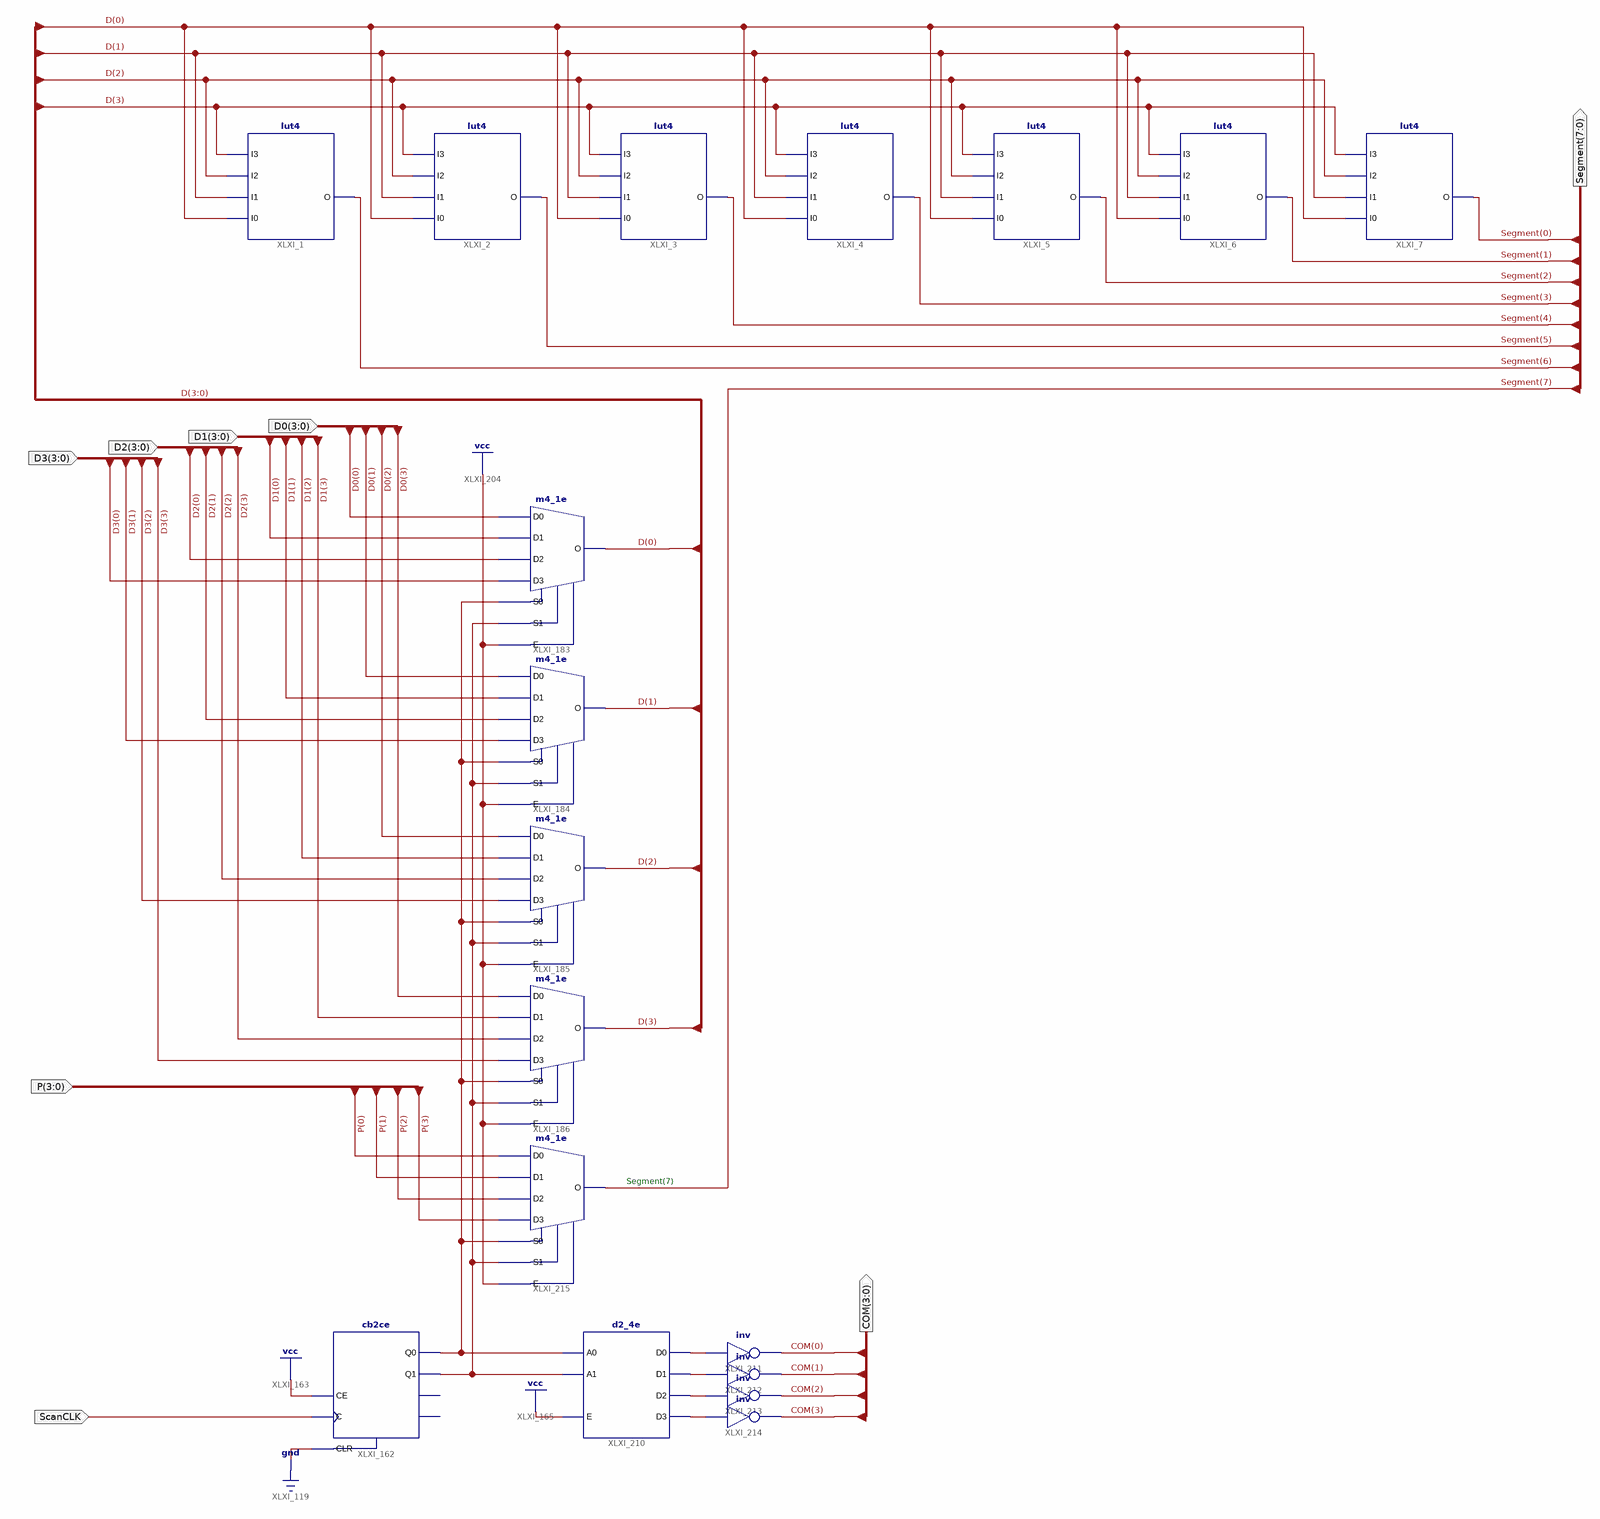
[diagram p0: schematic sheet 1]
// Xilinx ISE schematic ssd4d0ftpb.sch (spartan6) as structural Verilog: 18 symbols, 8 ports
module ssd4d0ftpb (
  input  [3:0] D0,
  input  [3:0] D1,
  input  [3:0] D2,
  input  [3:0] D3,
  input  [3:0] P,
  input  ScanCLK,
  output [7:0] Segment,
  output [3:0] COM
);

  wire XLXN_236, XLXN_237, XLXN_238, XLXN_239, XLXN_290, XLXN_291;
  wire [3:0] D;

  lut4 #(.INIT("EF7C")) XLXI_1 (.I0(D[0]), .I1(D[1]), .I2(D[2]), .I3(D[3]), .O(Segment[6]));
  lut4 #(.INIT("DF71")) XLXI_2 (.I0(D[0]), .I1(D[1]), .I2(D[2]), .I3(D[3]), .O(Segment[5]));
  lut4 #(.INIT("FD45")) XLXI_3 (.I0(D[0]), .I1(D[1]), .I2(D[2]), .I3(D[3]), .O(Segment[4]));
  lut4 #(.INIT("7B6D")) XLXI_4 (.I0(D[0]), .I1(D[1]), .I2(D[2]), .I3(D[3]), .O(Segment[3]));
  lut4 #(.INIT("2FFB")) XLXI_5 (.I0(D[0]), .I1(D[1]), .I2(D[2]), .I3(D[3]), .O(Segment[2]));
  lut4 #(.INIT("279F")) XLXI_6 (.I0(D[0]), .I1(D[1]), .I2(D[2]), .I3(D[3]), .O(Segment[1]));
  lut4 #(.INIT("D7ED")) XLXI_7 (.I0(D[0]), .I1(D[1]), .I2(D[2]), .I3(D[3]), .O(Segment[0]));
  m4_1e XLXI_183 (.D0(D0[0]), .D1(D1[0]), .D2(D2[0]), .D3(D3[0]), .E(1'b1), .S0(XLXN_290), .S1(XLXN_291), .O(D[0]));
  m4_1e XLXI_184 (.D0(D0[1]), .D1(D1[1]), .D2(D2[1]), .D3(D3[1]), .E(1'b1), .S0(XLXN_290), .S1(XLXN_291), .O(D[1]));
  m4_1e XLXI_185 (.D0(D0[2]), .D1(D1[2]), .D2(D2[2]), .D3(D3[2]), .E(1'b1), .S0(XLXN_290), .S1(XLXN_291), .O(D[2]));
  m4_1e XLXI_186 (.D0(D0[3]), .D1(D1[3]), .D2(D2[3]), .D3(D3[3]), .E(1'b1), .S0(XLXN_290), .S1(XLXN_291), .O(D[3]));
  m4_1e XLXI_215 (.D0(P[0]), .D1(P[1]), .D2(P[2]), .D3(P[3]), .E(1'b1), .S0(XLXN_290), .S1(XLXN_291), .O(Segment[7]));
  cb2ce XLXI_162 (.C(ScanCLK), .CE(1'b1), .CLR(1'b0), .Q0(XLXN_290), .Q1(XLXN_291));  // open: CEO, TC
  d2_4e XLXI_210 (.A0(XLXN_290), .A1(XLXN_291), .E(1'b1), .D0(XLXN_236), .D1(XLXN_237), .D2(XLXN_238), .D3(XLXN_239));
  not XLXI_211 (COM[0], XLXN_236);
  not XLXI_212 (COM[1], XLXN_237);
  not XLXI_213 (COM[2], XLXN_238);
  not XLXI_214 (COM[3], XLXN_239);

  // Notes on the sheet:
  //   Segment(7)
endmodule
